# Altium schematic sheet H750Common3.SchDoc
size A3
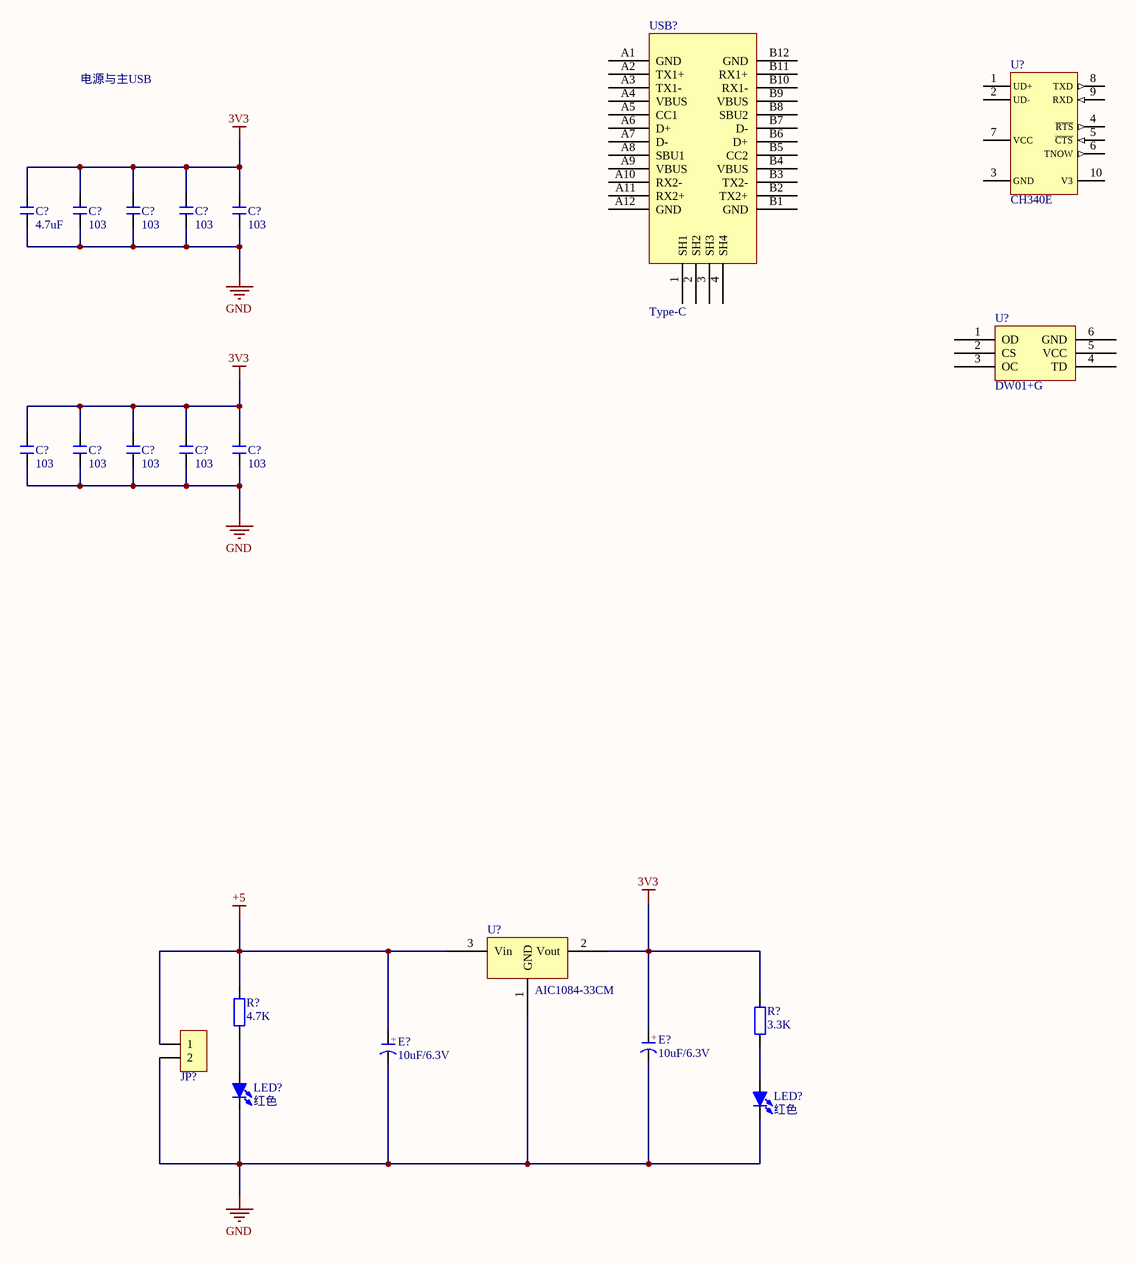
[diagram p0: H750Common3.SchDoc]

## Parts
(Parts that share a designator on the sheet are numbered #1, #2 ... from top to bottom, then left to right.)
C?#1  4.7uF  [C 0603_L]
C?#2  103  [C 0603_L]
C?#3  103  [C 0603_L]
C?#4  103  [C 0603_L]
C?#5  103  [C 0603_L]
C?#6  103  [C 0603_L]
C?#7  103  [C 0603_L]
C?#8  103  [C 0603_L]
C?#9  103  [C 0603_L]
C?#10  103  [C 0603_L]
E?#1  10uF/6.3V  [CD A(3216)]
E?#2  10uF/6.3V  [CD A(3216)]
JP?  HDR-1X2  [KF128-3.81-2P]  (value not drawn)
LED?#1  红色  [LED 0603R]
LED?#2  红色  [LED 0603B]
R?#1  4.7K  [R 0603_L]
R?#2  3.3K  [R 0603_L]
U?#1  CH340E  [MSOP-10]
U?#2  DW01+G  [SOT-23-6]
U?#3  AIC1084-33CM  [TO263-3B]
USB?  Type-C  [Type-C]

## Nets
3V3: C?#1.2 C?#2.2 C?#3.2 C?#4.2 C?#5.2 C?#6.2 C?#7.2 C?#8.2 C?#9.2 C?#10.2 E?#2.1(A) R?#2.1 U?#3.2(Vout)
+5: E?#1.1(A) JP?.1 R?#1.1 U?#3.3(Vin)
GND: C?#1.1 C?#2.1 C?#3.1 C?#4.1 C?#5.1 C?#6.1 C?#7.1 C?#8.1 C?#9.1 C?#10.1 E?#1.2(K) E?#2.2(K) JP?.2 LED?#1.2(K) LED?#2.2(K) U?#3.1(GND)
NetLED?#1_1: LED?#1.1(A) R?#1.2
NetLED?#2_1: LED?#2.1(A) R?#2.2

Not connected (* = marked no-connect by the designer): U?#1 1(UD+) 2(UD-) 3(GND) 4(~{RTS}) 5(~{CTS}) 6(TNOW) 7(VCC) 8(TXD) 9(RXD) 10(V3); U?#2 1(OD) 2(CS) 3(OC) 4(TD) 5(VCC) 6(GND); USB? 1(SH1) 2(SH2) 3(SH3) 4(SH4) A1(GND) A2(TX1+) A3(TX1-) A4(VBUS) A5(CC1) A6(D+) A7(D-) A8(SBU1) A9(VBUS) A10(RX2-) A11(RX2+) A12(GND) B1(GND) B2(TX2+) B3(TX2-) B4(VBUS) B5(CC2) B6(D+) B7(D-) B8(SBU2) B9(VBUS) B10(RX1-) B11(RX1+) B12(GND)

## Notes on the sheet
- 电源与主USB
- (in symbol C-CD) +

## Library data of the parts
C?#1-C?#10 = C: 无极性贴片电容; 版权归属: 源创客; BOM名称: 无极性贴片电容; 学习资源: www.ooocke.com
E?#1 E?#2 = C-CD: 贴片钽电容; 版权归属: 源创客; BOM名称: 贴片钽电容; 学习资源: www.ooocke.com
JP? = Header 2: 2P接插件; 版权归属: 源创客; BOM名称: 2P接插件; 学习资源: www.ooocke.com
LED?#1 LED?#2 = LED-SMD: 贴片LED; 版权归属: 源创客; BOM名称: 贴片LED; 学习资源: www.ooocke.com
R?#1 R?#2 = R: 贴片电阻; 版权归属: 源创客; BOM名称: 贴片电阻; 学习资源: www.ooocke.com
U?#1 = CH340E: USB 转 串口
U?#2 = DW01+G_[C14213]: 电池保护芯片; ComponentLink1Description: 供应商链接; ComponentLink1URL: http://www.szlcsc.com/product/details_14870.html; Package: SOT-23-6; Supplier: LC; SuppliersPartNumber: C14213
U?#3 = AIC1084-33CM: pin to pad: 1>G 2>D 3>S